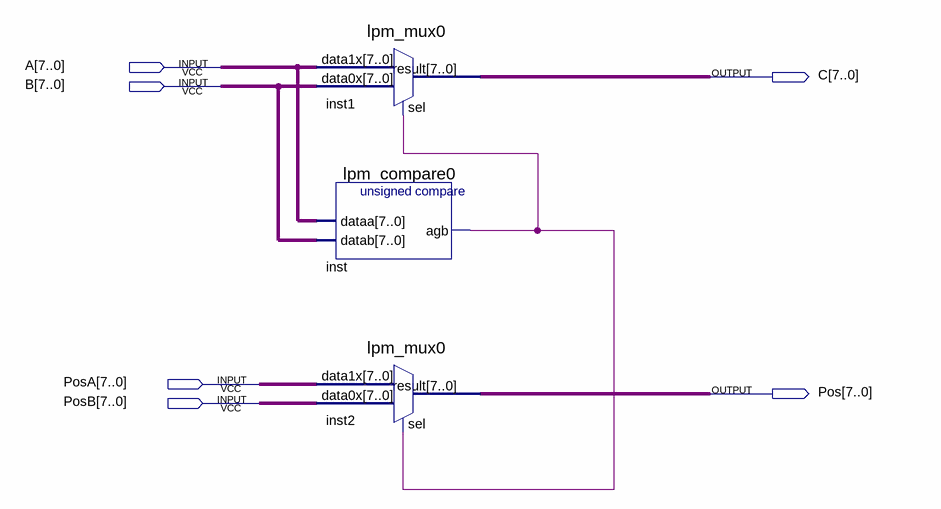
[diagram p0: schematic sheet]
// Quartus schematic Max2data.bdf as structural Verilog: 3 symbols, 6 pins
module Max2data (
  input  [7:0] A,
  input  [7:0] B,
  input  [7:0] PosA,
  input  [7:0] PosB,
  output [7:0] C,
  output [7:0] Pos
);

  wire inst_agb;

  lpm_mux0 inst1 (.data1x(A), .data0x(B), .sel(inst_agb), .result(C));
  lpm_compare0 inst (.dataa(A), .datab(B), .agb(inst_agb));
  lpm_mux0 inst2 (.data1x(PosA), .data0x(PosB), .sel(inst_agb), .result(Pos));
endmodule
